# EasyEDA Pro project AUTO_TOOL_VINF_2025-05-17.epro, schematic Schematic1
Create Date: 2025-04-22; Page Name: P1; Project Name: AUTO_TOOL_VINF; Schematic Name: Schematic1; Update Date: 2025-04-24; Company: EasyEDA.com; Page Size: A4; Version: V1.0
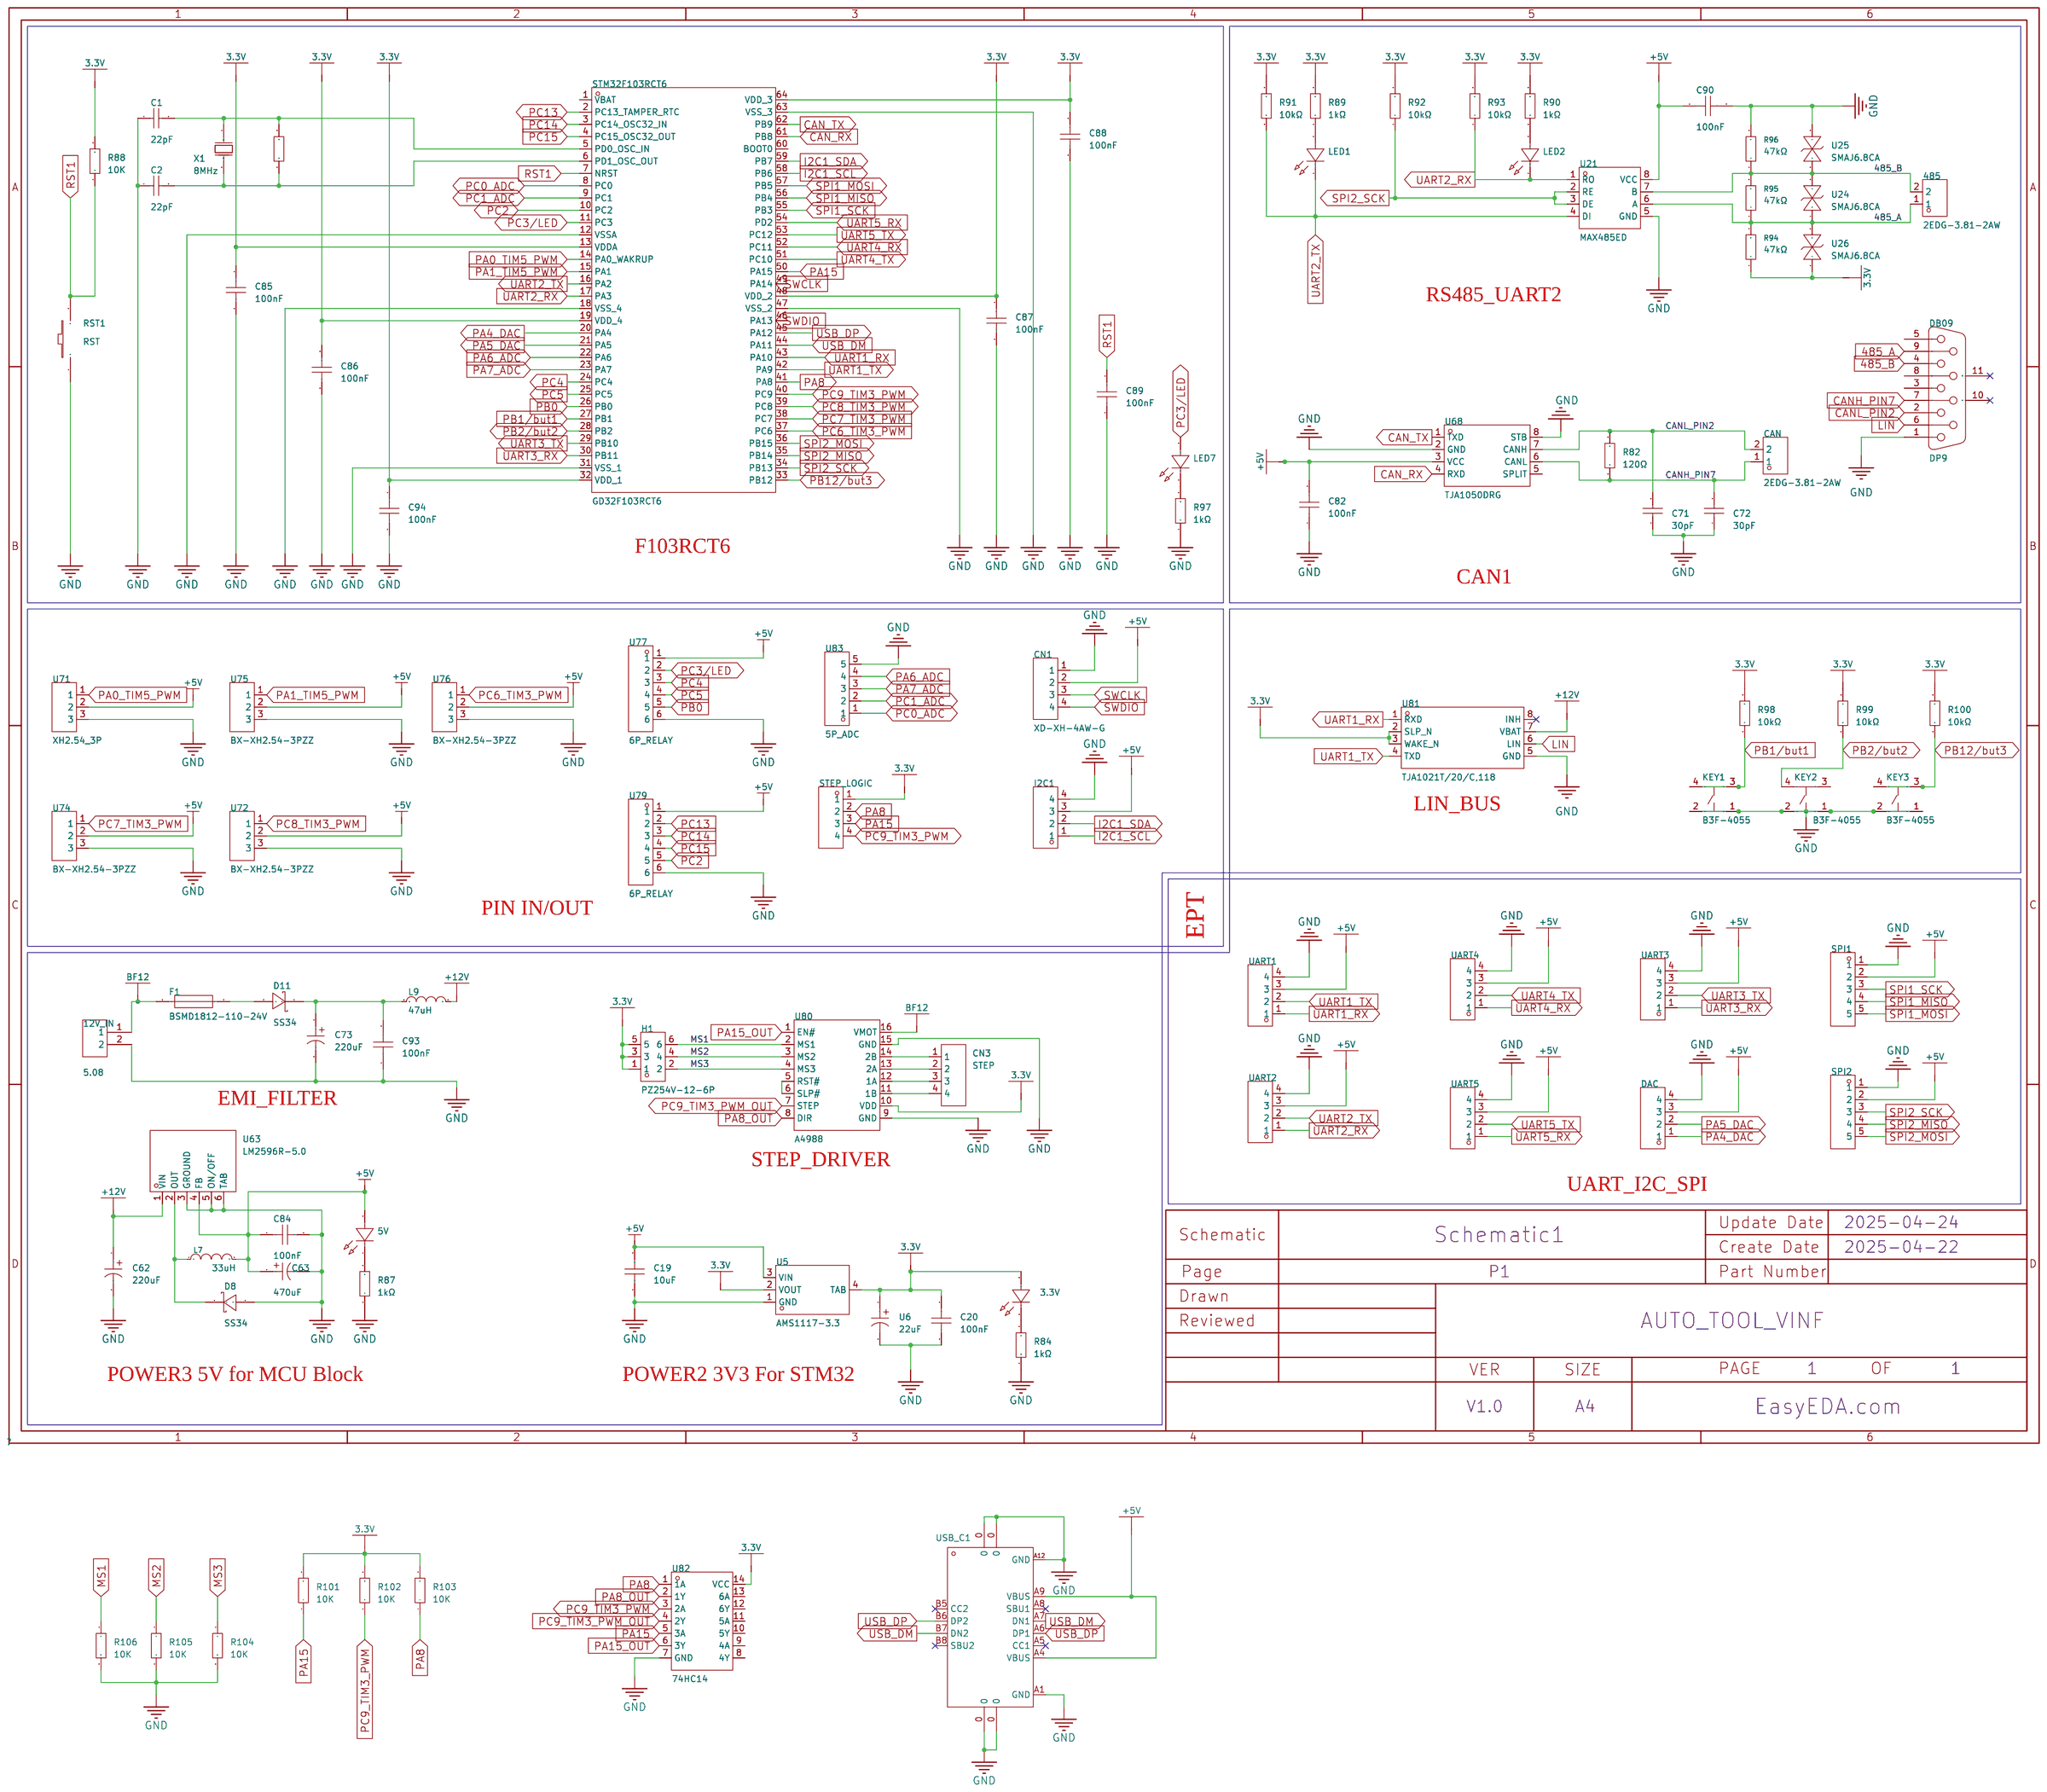
[diagram p0: schematic sheet]

## Parts
3.3V  17-21SURC/S530-A3/4T  [LED0805-RD_ORANGE]
5V  17-21SURC/S530-A3/4T  [LED0805-RD_ORANGE]
12V_IN  5.08  [CONN-TH_2P-P5.00_WJ500V-5.08-2P]
485  2EDG-3.81-2AW  [CONN-TH_2EDG-3.81-2AW]
C1  22pF  [C0603]
C2  22pF  [C0603]
C19  10uF  [C0805]
C20  100nF  [C0805]
C62  220uF  [CAP-TH_BD8.0-P3.50-D0.6-FD_1]
C63  470uF  [CAP-TH_BD8.0-P3.50-D0.5-FD]
C71  30pF  [C0603]
C72  30pF  [C0603]
C73  220uF  [CAP-TH_BD8.0-P3.50-D0.6-FD_1]
C82  100nF  [C0805]
C84  100nF  [C0805]
C85  100nF  [C0805]
C86  100nF  [C0805]
C87  100nF  [C0805]
C88  100nF  [C0805]
C89  100nF  [C0805]
C90  100nF  [C0805]
C93  100nF  [C0805]
C94  100nF  [C0805]
CAN  2EDG-3.81-2AW  [CONN-TH_2EDG-3.81-2AW]
CN1  XD-XH-4AW-G  [CONN-TH_XD-XH-4AW-G]
CN3  STEP  [CONN-TH_XD-XH-4AW-G]
D8  SS34  [SMA_L4.3-W2.6-LS5.2-RD]
D11  SS34  [SMA_L4.3-W2.6-LS5.2-RD]
DAC  ZX-XH2.54-4PZZ  [CONN-TH_4P-P2.50_4PIN]
DB09  DP9  [DSUB-TH_DMR-9P]
F1  BSMD1812-110-24V  [F1812]
H1  PZ254V-12-6P  [HDR-TH_6P-P2.54-V-M-R2-C3-S2.54]
I2C1  ZX-XH2.54-4PZZ  [CONN-TH_4P-P2.50_4PIN]
KEY1  B3F-4055  [KEY-TH_4P-L12.0-W12.0-P5.00-LS13.4-EH]
KEY2  B3F-4055  [KEY-TH_4P-L12.0-W12.0-P5.00-LS13.4-EH]
KEY3  B3F-4055  [KEY-TH_4P-L12.0-W12.0-P5.00-LS13.4-EH]
L7  33uH  [IND-SMD_L12.0-W12.0]
L9  47uH  [IND-TH_L14.5-W7.0-P7.0-D0.6_XR5026T470MVL7]
LED1  17-21SURC/S530-A3/4T  [LED0805-RD_ORANGE]
LED2  17-21SURC/S530-A3/4T  [LED0805-RD_ORANGE]
LED7  17-21SURC/S530-A3/4T  [LED0805-RD_ORANGE]
R32  1MΩ  [R0603]
R82  120Ω  [R0805]
R84  1kΩ  [R0805]
R87  1kΩ  [R0805]
R88  10K  [R0805]
R89  1kΩ  [R0805]
R90  1kΩ  [R0805]
R91  10kΩ  [R0805]
R92  10kΩ  [R0805]
R93  10kΩ  [R0805]
R94  47kΩ  [R0805]
R95  47kΩ  [R0805]
R96  47kΩ  [R0805]
R97  1kΩ  [R0805]
R98  10kΩ  [R0805]
R99  10kΩ  [R0805]
R100  10kΩ  [R0805]
R101  10K  [R0805]
R102  10K  [R0805]
R103  10K  [R0805]
R104  10K  [R0805]
R105  10K  [R0805]
R106  10K  [R0805]
RST1  RST  [SW-SMD_L6.1-W3.6-LS8.0]
SPI1  XY-XH2.54-5A11  [HDR-TH_5P-P2.50-V-F-2]
SPI2  XY-XH2.54-5A11  [HDR-TH_5P-P2.50-V-F-2]
STEP_LOGIC  ZX-XH2.54-4PZZ  [CONN-TH_4P-P2.50_4PIN]
STM32F103RCT6  GD32F103RCT6  [LQFP-64_L10.0-W10.0-P0.50-LS12.0-BL]
U5  AMS1117-3.3  [SOT-223-3_L6.5-W3.5-P3.05-LS7.0]
U6  22uF  [CAP-TH_BD4.0-P2.00-D0.5-FD]
U21  MAX485ED  [SOP-8_L4.9-W3.9-P1.27-LS6.0-BL]
U24  SMAJ6.8CA  [SMA_L4.3-W2.6-LS5.1-BI]
U25  SMAJ6.8CA  [SMA_L4.3-W2.6-LS5.1-BI]
U26  SMAJ6.8CA  [SMA_L4.3-W2.6-LS5.1-BI]
U63  LM2596R-5.0  [TO-263-5_L10.2-W8.6-P1.70-LS14.4-TL]
U68  TJA1050DRG  [SOP-8_L4.9-W3.9-P1.27-LS6.0-BL]
U71  XH2.54_3P  [CONN-TH_3P-P2.50_BX-XH2.54-3PZZ]
U72  BX-XH2.54-3PZZ  [CONN-TH_3P-P2.50_BX-XH2.54-3PZZ]
U74  BX-XH2.54-3PZZ  [CONN-TH_3P-P2.50_BX-XH2.54-3PZZ]
U75  BX-XH2.54-3PZZ  [CONN-TH_3P-P2.50_BX-XH2.54-3PZZ]
U76  BX-XH2.54-3PZZ  [CONN-TH_3P-P2.50_BX-XH2.54-3PZZ]
U77  6P_RELAY  [CONN-TH_6P-P2.50_WAFER-XH254WZ-6A]
U79  6P_RELAY  [CONN-TH_6P-P2.50_WAFER-XH254WZ-6A]
U80  A4988  [DIP-16_L20.3-W15.2-P2.54_LS12.7_A4988]
U81  TJA1021T/20/C,118  [SO-8_L4.9-W3.9-P1.27-LS5.9-BL]
U82  74HC14  [SOIC-14_L8.7-W3.9-P1.27-LS6.0-BL]
U83  5P_ADC  [CONN-TH_5P-P2.50_WAFER-XH254WZ-5A]
UART1  ZX-XH2.54-4PZZ  [CONN-TH_4P-P2.50_4PIN]
UART2  ZX-XH2.54-4PZZ  [CONN-TH_4P-P2.50_4PIN]
UART3  ZX-XH2.54-4PZZ  [CONN-TH_4P-P2.50_4PIN]
UART4  ZX-XH2.54-4PZZ  [CONN-TH_4P-P2.50_4PIN]
UART5  ZX-XH2.54-4PZZ  [CONN-TH_4P-P2.50_4PIN]
USB_C1  918-418K2023S40001  [USB-C-SMD_TYPE-C-USB-17]
X1  8MHz  [OSC-SMD_L5.0-W3.2]

## Library data of the parts
3.3V 5V LED1 LED2 LED7 = 17-21SURC/S530-A3/4T: Emitted Color:Orange-red Power Dissipation:60mW Forward Current:20mA Dominant Wavelength:624nm Dominant Wavelength:624nm Peak Wavelength:632nm Diode Configuration:- Lens Color:Colorless transparent lens Color Temperature:- Color Temperature:- Viewing Angl; LCSC Part Name: 橙红 正贴; Supplier Part: C2943978; Manufacturer: EVERLIGHT(亿光); Supplier Footprint: 0805; JLCPCB Part Class: Extended Part; Datasheet: https://atta.szlcsc.com/upload/public/pdf/source/20220318/905DC8A7115F268F033B3130889FCFCC.pdf; Supplier: LCSC; Emitted Color: Orange-red; Power Dissipation: 60mW; Forward Current: 20mA; Dominant Wavelength: 624nm; Peak Wavelength: 632nm; Lens Color: Colorless transparent lens; Viewing Angle: 140°; Mounting Sytle: Positive Stick; Operating Temperature: -40℃~+85℃
12V_IN = WJ500V-5.08-2P: Structure:1x2P Pitch:5.08mm Color:Green Mounting Style:Direct Insert Current Rating (Max):18A Voltage Rating (Max):250V Number of Pins:2P Number of Rows:1 Wire Gauge - AWG:14~30 Wire Gauge - AWG:14~30 Wire Gauge - mm2:2.5 Wire Gauge - mm2:2.5 Number of PI; LCSC Part Name: 1x2P 5.08mm 直插 排数:1 每排P数:2; Supplier Part: C8465; Manufacturer: KANGNEX(康奈克斯电气); Supplier Footprint: 插件,P=5.08mm; JLCPCB Part Class: Extended Part; Datasheet: https://atta.szlcsc.com/upload/public/pdf/source/20191225/C8465_02D34CE5B5B4A53DF5891601D97FA9F4.pdf; Supplier: LCSC; Structure: 1x2P; Pitch: 5.08mm; Color: Green; Mounting Style: Direct Insert; Current Rating (Max): 18A; Voltage Rating (Max): 250V; Number of Pins: 2P; Number of Rows: 1; Wire Gauge - AWG: 14~30; Wire Gauge - mm2: 2.5; Number of PINs Per Row: 2; Operating Temperature Range: -40℃~+105℃; Screw Specification: M2.5
485 CAN = 2EDG-3.81-2AW: Supplier Part: C22397851; Manufacturer: DLL(德利); Supplier Footprint: 弯插,P=3.81mm; Datasheet: https://atta.szlcsc.com/upload/public/pdf/source/20240513/43EA5A17C77C66A9D89BAF047811F59A.pdf; Supplier: LCSC
C1 C2 = 0603N220J500: Temperature Coefficient: Body Length:- Body Width:- Body Thickness:- Tolerance: Tolerance: Voltage Rated: Capacitance:; LCSC Part Name: 22pF ±5% 50V; Supplier Part: C107451; Manufacturer: Walsin(华新科); Supplier Footprint: 0603; Datasheet: https://atta.szlcsc.com/upload/public/pdf/source/20170726/C107451_1501054454938843912.pdf; Supplier: LCSC
C19 = CL21A106KAYNNNE_C15850: Capacitance: Tolerance:±10% Tolerance:±10% Voltage Rated: Temperature Coefficient:; LCSC Part Name: 10uF ±10% 25V; Supplier Part: C15850; Manufacturer: SAMSUNG(三星); Manufacturer Part: CL21A106KAYNNNE; Supplier Footprint: 0805; JLCPCB Part Class: Basic Part; Datasheet: https://atta.szlcsc.com/upload/public/pdf/source/20160218/1457707763339.pdf; Supplier: LCSC; Tolerance: ±10%
C20 C82 C84-C90 C93 C94 = CC0805KRX7R9BB104: Capacitance: Tolerance:±10% Tolerance:±10% Voltage Rated: Temperature Coefficient:; LCSC Part Name: 100nF ±10% 50V; Supplier Part: C49678; Manufacturer: YAGEO(国巨); Supplier Footprint: 0805; JLCPCB Part Class: Basic Part; Datasheet: https://atta.szlcsc.com/upload/public/pdf/source/20180224/C181747_15194369449651363981.pdf; Supplier: LCSC; Tolerance: ±10%
C62 C73 = 35V220uF CD110: Capacitance: Tolerance:±20% Tolerance:±20% Rated Voltage: Lead Spacing: φD: L: Operating Temperature:-40℃~+105℃ Operating Temperature:-40℃~+105℃; LCSC Part Name: 220uF ±20% 35V; Supplier Part: C2960236; Manufacturer: HRK(鸿瑞凯电子); Supplier Footprint: 插件,D8xL12mm; JLCPCB Part Class: Extended Part; Datasheet: https://atta.szlcsc.com/upload/public/pdf/source/20220224/7F5DF6788BF91316DB22641A0841F4D2.pdf; Supplier: LCSC; Tolerance: ±20%; Operating Temperature: -40℃~+105℃
C63 = 16V470uF CD288: Capacitance: Tolerance:±20% Tolerance:±20% Rated Voltage: Lead Spacing: φD: L: Operating Temperature:-40℃~+105℃ Operating Temperature:-40℃~+105℃; LCSC Part Name: 470uF ±20% 16V; Supplier Part: C2960229; Manufacturer: HRK(鸿瑞凯电子); Supplier Footprint: 插件,D8xL12mm; JLCPCB Part Class: Extended Part; Datasheet: https://atta.szlcsc.com/upload/public/pdf/source/20220224/FE29CCFF73BAE8397AB6AC08AF83FCA7.pdf; Supplier: LCSC; Tolerance: ±20%; Operating Temperature: -40℃~+105℃
C71 C72 = 0603CG300J500NT: Capacitance:30pF Tolerance:±5% Tolerance:±5% Voltage Rating:50V Temperature Coefficient:C0G; LCSC Part Name: 30pF ±5% 50V; Supplier Part: C1658; Manufacturer: FH(风华); Supplier Footprint: 0603; Datasheet: https://atta.szlcsc.com/upload/public/pdf/source/20200305/C486355_26A10D38EF8C2A5C37091D0039909270.pdf; Supplier: LCSC; Tolerance: ±5%; Voltage Rating: 50V; Temperature Coefficient: C0G
CN1 CN3 = XD-XH-4AW-G: Pins Structure:1x4P Pitch:2.54mm Mounting Type:Bend-in Reference Series:XH Number of Pins:4P Number of Rows:1 Number of PINs Per Row:4 Row Spacing:2.54mm Current Rating:3A Operating Temperature:-25℃~+85℃ Operating Temperature:-25℃~+85℃; LCSC Part Name: 1x4P 间距:2.54mm 弯插 系列:XH; Supplier Part: C17700963; Manufacturer: XUNDA(讯答); Supplier Footprint: 插件,P=2.5mm; Datasheet: https://atta.szlcsc.com/upload/public/pdf/source/20231019/EDD688933EF3B2A2948A0AD0307CAFB3.pdf; Supplier: LCSC; Pins Structure: 1x4P; Pitch: 2.54mm; Mounting Type: Bend-in; Reference Series: XH; Number of Pins: 4P; Number of Rows: 1; Number of PINs Per Row: 4; Row Spacing: 2.54mm; Current Rating: 3A; Operating Temperature: -25℃~+85℃
D8 D11 = SS34_C8678: Diode Configuration:Independent Type Forward Voltage (Vf@If):550mV@3A Reverse Voltage (Vr):40V Rectified Current:3A Reverse Leakage Current (Ir):500uA@40V; LCSC Part Name: 电压:40V 电流:3A; Supplier Part: C8678; Manufacturer: MDD(辰达半导体); Supplier Footprint: SMA(DO-214AC); JLCPCB Part Class: Basic Part; Datasheet: https://atta.szlcsc.com/upload/public/pdf/source/20240710/2118BB86FDDB2E0B294389AC1F3F65C8.pdf; Supplier: LCSC; Diode Configuration: Independent Type; Forward Voltage (Vf@If): 550mV@3A; Reverse Voltage (Vr): 40V; Rectified Current: 3A; Reverse Leakage Current (Ir): 500uA@40V
DAC I2C1 STEP_LOGIC UART1-UART5 = ZX-XH2.54-4PZZ: Pins Structure:1x4P Pitch:2.54mm Mounting Style:Straight Reference Series:XH Number of Pins:4P Number of Rows:1 Number of PINs Per Row:4 Row Spacing:- Current Rating (Max):3A Contact Material:Brass Contact Plating:Tin Operating Temperature Range:-25℃~+85℃; Supplier Part: C7429634; Manufacturer: Megastar(兆星); Supplier Footprint: 插件,P=2.54mm; JLCPCB Part Class: Extended Part; Datasheet: https://atta.szlcsc.com/upload/public/pdf/source/20230619/B529A2163E0159A644AB3383D208FB03.pdf; Supplier: LCSC; Pins Structure: 1x4P; Pitch: 2.54mm; Mounting Style: Straight; Reference Series: XH; Number of Pins: 4P; Number of Rows: 1; Number of PINs Per Row: 4; Current Rating (Max): 3A; Contact Material: Brass; Contact Plating: Tin; Operating Temperature Range: -25℃~+85℃
DB09 = D-DMR009PM-D002: Connector Type:常规D-Sub Gender:Male Number of Pins:9P Mounting Style:Bend insert Number of Rows:2 Current Rating-Signal (Max):3A Current Rating-Power (Max):- Rated Voltage (Max):- Colour:Black Operating Temperature Range:-50℃~+105℃ Operating Temperature Ra; LCSC Part Name: D-Sub 公 P数:9P; Supplier Part: C141880; Manufacturer: Ckmtw(灿科盟); Supplier Footprint: 弯插; JLCPCB Part Class: Extended Part; Datasheet: https://atta.szlcsc.com/upload/public/pdf/source/20171123/C141880_15114109678101137623.pdf; Supplier: LCSC; Connector Type: 常规D-Sub; Gender: Male; Number of Pins: 9P; Mounting Style: Bend insert; Number of Rows: 2; Current Rating-Signal (Max): 3A; Colour: Black; Operating Temperature Range: -50℃~+105℃
F1 = BSMD1812-110-24V: Voltage - Max:24V Current - Max:40A Hold Current:1.1A Trip Current:2.2A Power Dissipation:1W Resistance - Initial (Ri) (Min):45mΩ Resistance - Post Trip (R1) (Max):250mΩ Time to Trip(Max):300ms Operating Temperature:-40℃~+85℃ Operating Temperature:-40℃~+8; LCSC Part Name: 24V 1.1A 1812自恢复; Supplier Part: C883149; Manufacturer: BHFUSE(佰宏); Supplier Footprint: 1812; JLCPCB Part Class: Extended Part; Datasheet: https://atta.szlcsc.com/upload/public/pdf/source/20250227/B9B584AA29F5C747EA0BFD5D6B2BB17B.pdf; Supplier: LCSC; Voltage - Max: 24V; Current - Max: 40A; Hold Current: 1.1A; Trip Current: 2.2A; Power Dissipation: 1W; Resistance - Initial (Ri) (Min): 45mΩ; Resistance - Post Trip (R1) (Max): 250mΩ; Time to Trip(Max): 300ms; Operating Temperature: -40℃~+85℃
H1 = PZ254V-12-6P: Pin Structure:2x3P Pitch:2.54mm Row Spacing:2.54mm Circluar Pins/Square Pins:Square Pins Mounting Type:Straight Number of Rows:双排 Number of Pins:6P Current Rating (Max):- Voltage Rating (Max):- Length of Mating Pin:6mm Insulation Height:2.5mm Length of En; LCSC Part Name: 间距:2.54mm 2x3P 直插 方针; Supplier Part: C492420; Manufacturer: XFCN(兴飞); Supplier Footprint: 插件,P=2.54mm; JLCPCB Part Class: Extended Part; Datasheet: https://atta.szlcsc.com/upload/public/pdf/source/20200309/C492420_BAECB307B001054C09D200388220EAE6.pdf; Supplier: LCSC; Pin Structure: 2x3P; Pitch: 2.54mm; Row Spacing: 2.54mm; Circluar Pins/Square Pins: Square Pins; Mounting Type: Straight; Number of Rows: 双排; Number of Pins: 6P; Length of Mating Pin: 6mm; Insulation Height: 2.5mm; Length of End Connection Pin: 3mm; Operating Temperature Range: -40℃~+105℃; Color: Black
KEY1-KEY3 = B3F-4055_C84931: Circuit:SPST Actuator Style:Rectangle button Mounting Style:Direct Insert Switch Length:12mm Switch Width:12mm Switch Height:7.3mm Contact Current:50mA Voltage Rating (DC):24V With Lamp:- Mechanical Life:-; LCSC Part Name: 12*12*7.3mm 直插 轻触开关; Supplier Part: C84931; Manufacturer: OMRON(欧姆龙); Supplier Footprint: 插件; JLCPCB Part Class: Extended Part; Datasheet: https://atta.szlcsc.com/upload/public/pdf/source/20170810/C93157_1502335414592880008.pdf; Supplier: LCSC; Circuit: SPST; Actuator Style: Rectangle button; Mounting Style: Direct Insert; Switch Length: 12mm; Switch Width: 12mm; Switch Height: 7.3mm; Contact Current: 50mA; Voltage Rating (DC): 24V
L7 = SLH1207S330MTT: Inductance: Tolerance:±20% Tolerance:±20% Rated Current: DC Resistance (DCR):; LCSC Part Name: 33uH ±20%; Supplier Part: C181844; Manufacturer: Sunltech(韩国顺磁); Supplier Footprint: SMD; JLCPCB Part Class: Extended Part; Datasheet: https://atta.szlcsc.com/upload/public/pdf/source/20180509/C216200_948378E1D3CCC25B70CFE5927CB2C576.pdf; Supplier: LCSC; Tolerance: ±20%
L9 = XR5026T470MVL7: Inductance: Tolerance:±10% Tolerance:±10% Rated Current:4A Type:Magnetic ring inductance Wire Diameter:0.7mm; LCSC Part Name: 47uH ±10% 磁环电感; Supplier Part: C22358330; Manufacturer: XR(祥如); Supplier Footprint: 插件,D=14.5mm; Datasheet: https://atta.szlcsc.com/upload/public/pdf/source/20240313/542712E3DA5CB74393915CBFE698D485.pdf; Supplier: LCSC; Tolerance: ±10%; Rated Current: 4A; Type: Magnetic ring inductance; Wire Diameter: 0.7mm
R32 = 0603WAF1004T5E: Type:Thick Film Resistors Resistance:1MΩ Tolerance:±1% Tolerance:±1% Power(Watts): Overload Voltage (Max): Temperature Coefficient:±100ppm/℃ Temperature Coefficient:±100ppm/℃ Operating Temperature Range:-55℃~+155℃ Operating Temperature Range:-55℃~+155℃; LCSC Part Name: 1MΩ ±1% 100mW 厚膜电阻; Supplier Part: C22935; Manufacturer: UNI-ROYAL(厚声); Supplier Footprint: 0603; JLCPCB Part Class: Basic Part; Datasheet: https://atta.szlcsc.com/upload/public/pdf/source/20200306/C422600_1E6D84923E4A46A82E41ADD87F860B5C.pdf; Supplier: LCSC; Type: Thick Film Resistors; Tolerance: ±1%; Temperature Coefficient: ±100ppm/℃; Operating Temperature Range: -55℃~+155℃
R82 = RC0805FR-07120RL: Type:Thick Film Resistors Resistance: Tolerance:±1% Tolerance:±1% Power(Watts): Overload Voltage (Max): Temperature Coefficient:±100ppm/℃ Temperature Coefficient:±100ppm/℃ Operating Temperature Range:-55℃~+155℃ Operating Temperature Range:-55℃~+155℃; LCSC Part Name: 厚膜电阻 120Ω ±1% 125mW; Supplier Part: C114245; Manufacturer: YAGEO(国巨); Supplier Footprint: 0805; JLCPCB Part Class: Extended Part; Datasheet: https://atta.szlcsc.com/upload/public/pdf/source/20180821/C275644_0D56F95EFF785E7D9A1FEF436B37DA78.pdf; Supplier: LCSC; Type: Thick Film Resistors; Tolerance: ±1%; Temperature Coefficient: ±100ppm/℃; Operating Temperature Range: -55℃~+155℃
R84 R87-R90 R97-R106 = RC0805FR-071KL: Type:Thick Film Resistors Resistance: Tolerance:±1% Tolerance:±1% Power(Watts): Overload Voltage (Max): Temperature Coefficient:±100ppm/℃ Temperature Coefficient:±100ppm/℃ Operating Temperature Range:-55℃~+155℃ Operating Temperature Range:-55℃~+155℃; LCSC Part Name: 厚膜电阻 1kΩ ±1% 125mW; Supplier Part: C95781; Manufacturer: YAGEO(国巨); Supplier Footprint: 0805; JLCPCB Part Class: Extended Part; Datasheet: https://atta.szlcsc.com/upload/public/pdf/source/20170708/1499509500945.pdf; Supplier: LCSC; Type: Thick Film Resistors; Tolerance: ±1%; Temperature Coefficient: ±100ppm/℃; Operating Temperature Range: -55℃~+155℃
R91-R93 = RC0805FR-0710KL: Type:Thick Film Resistors Resistance: Tolerance:±1% Tolerance:±1% Power(Watts): Overload Voltage (Max): Temperature Coefficient:±100ppm/℃ Temperature Coefficient:±100ppm/℃ Operating Temperature Range:-55℃~+155℃ Operating Temperature Range:-55℃~+155℃; LCSC Part Name: 厚膜电阻 10kΩ ±1% 125mW; Supplier Part: C84376; Manufacturer: YAGEO(国巨); Supplier Footprint: 0805; JLCPCB Part Class: Extended Part; Datasheet: https://atta.szlcsc.com/upload/public/pdf/source/20170708/1499509500945.pdf; Supplier: LCSC; Type: Thick Film Resistors; Tolerance: ±1%; Temperature Coefficient: ±100ppm/℃; Operating Temperature Range: -55℃~+155℃
R94-R96 = 0805W8F4702T5E: Type:Thick Film Resistors Resistance:47kΩ Tolerance:±1% Tolerance:±1% Power(Watts): Overload Voltage (Max): Temperature Coefficient:±100ppm/℃ Temperature Coefficient:±100ppm/℃ Operating Temperature Range:-55℃~+155℃ Operating Temperature Range:-55℃~+155℃; LCSC Part Name: 47kΩ ±1% 125mW 厚膜电阻; Supplier Part: C17713; Manufacturer: UNI-ROYAL(厚声); Supplier Footprint: 0805; JLCPCB Part Class: Basic Part; Datasheet: https://atta.szlcsc.com/upload/public/pdf/source/20200306/C422600_1E6D84923E4A46A82E41ADD87F860B5C.pdf; Supplier: LCSC; Type: Thick Film Resistors; Tolerance: ±1%; Temperature Coefficient: ±100ppm/℃; Operating Temperature Range: -55℃~+155℃
RST1 = 轻触开关,3*6*2.5塑头白色,260G,行程0.25mm,贴片 (SMT业务专用): LCSC Part Name: 轻触开关,3*6*2.5塑头白色,260G,行程0.25mm,贴片   (SMT业务专用); Supplier Part: C71857; Supplier Footprint: SMD; JLCPCB Part Class: Extended Part; Datasheet: https://atta.szlcsc.com/upload/public/pdf/source/20160427/1461725218304.pdf; Supplier: LCSC
SPI1 SPI2 = XY-XH2.54-5A11: Pins Structure:1x5P Pitch:2.54mm Mounting Style:Straight Number of Pins:5P Number of Rows:1 Number of PINs Per Row:5 Row Spacing:2.54mm Current Rating (Max):2A Operating Temperature Range:-25℃~+85℃ Operating Temperature Range:-25℃~+85℃; LCSC Part Name: 1x5P 间距:2.54mm 直插; Supplier Part: C19271371; Manufacturer: XYECONN(辛译); Supplier Footprint: 插件,P=2.54mm; JLCPCB Part Class: Extended Part; Datasheet: https://atta.szlcsc.com/upload/public/pdf/source/20231124/FE6C94FEE8E92153564DB6B2026F1152.pdf; Supplier: LCSC; Pins Structure: 1x5P; Pitch: 2.54mm; Mounting Style: Straight; Number of Pins: 5P; Number of Rows: 1; Number of PINs Per Row: 5; Row Spacing: 2.54mm; Current Rating (Max): 2A; Operating Temperature Range: -25℃~+85℃
STM32F103RCT6 = GD32F103RCT6: CPU Core:CM3 Program Storage Size:256KB RAM Size:48KB GPIO Ports Number:51 Operating Voltage Range:2.6V~3.6V Operating Voltage Range:2.6V~3.6V CPU Maximum Speed:108MHz Program Memory Type:FLASH Operating Temperature Range:-40℃~+85℃ Operating Temperature R; LCSC Part Name: Arm® Cortex®-M3 32-bit MCU; Supplier Part: C80687; Manufacturer: GigaDevice(兆易创新); Supplier Footprint: LQFP-64(10x10); JLCPCB Part Class: Extended Part; Datasheet: https://atta.szlcsc.com/upload/public/pdf/source/20160910/1473490296871.pdf; Supplier: LCSC; CPU Core: CM3; Program Storage Size: 256KB; RAM Size: 48KB; GPIO Ports Number: 51; Operating Voltage Range: 2.6V~3.6V; CPU Maximum Speed: 108MHz; Program Memory Type: FLASH; Operating Temperature Range: -40℃~+85℃; ADC (Bit): 12bit; DAC (Bit): 12bit; PWM (Bit): 16bit; 16Bit Timer: 6; CAN: 1; UART/USART: 5; I2C: 2; SPI: 3; Universal Serial Bus: 有; Peripheral/Function: On-chip temperature sensor；DMA；WDT；LIN总线协议；PWM；IrDA；SDIO；RTC实时时钟; Watchdog: 有; Real-Time Clock: 有; Infrared Data Association: 有; Secure Digital Input and Output: 有; Direct Memory Access: 有; Internal Oscillator: 有
U5 = AMS1117-3.3_C5250992: Output Type:Fixed Maximum Input Voltage:12V Output Voltage:3.3V Output Voltage:3.3V Output Current:1A Power Supply Rejection Ratio (PSRR):70dB@(120Hz) Operating Temperature:-40℃~+125℃@(Tj) Operating Temperature:-40℃~+125℃@(Tj) Output Polarity:Positive ele; Supplier Part: C5250992; Manufacturer: TWGMC(台湾迪嘉); Supplier Footprint: SOT-223-3L; JLCPCB Part Class: Extended Part; Datasheet: https://atta.szlcsc.com/upload/public/pdf/source/20221109/A58A92B07670E85D28928AE371260E8D.pdf; Supplier: LCSC; Output Type: Fixed; Maximum Input Voltage: 12V; Output Voltage: 3.3V; Output Current: 1A; Power Supply Rejection Ratio (PSRR): 70dB@(120Hz); Operating Temperature: -40℃~+125℃@(Tj); Output Polarity: Positive electrode; Number of Outputs: 1
U6 = KM1E220M0407: Capacitance:22uF Tolerance:±20% Tolerance:±20% Voltage Rating:25V Ripple Current:48mA@120kHz Equivalent Series Resistance(ESR):- Pin Spacing:- Diameter:4mm Height - Seated (Max):7mm Lifetime:2000hrs@105℃ Operating Temperature:-40℃~+105℃ Operating Temperat; LCSC Part Name: 22uF ±20% 25V; Supplier Part: C2873975; Manufacturer: ROQANG(容强); Supplier Footprint: 插件,D4xL7mm; JLCPCB Part Class: Extended Part; Datasheet: https://atta.szlcsc.com/upload/public/pdf/source/20210825/43CC5C3A3C9845108B639C21E16A1224.pdf; Supplier: LCSC; Tolerance: ±20%; Voltage Rating: 25V; Ripple Current: 48mA@120kHz; Diameter: 4mm; Height - Seated (Max): 7mm; Lifetime: 2000hrs@105℃; Operating Temperature: -40℃~+105℃
U21 = MAX485ED: Supplier Part: C481667; Manufacturer: HTC; Supplier Footprint: SOP-8; JLCPCB Part Class: Extended Part; Datasheet: https://atta.szlcsc.com/upload/public/pdf/source/20200113/C481667_86CA12344B2034BBC3F3085D860BEB7C.pdf; Supplier: LCSC
U24-U26 = SMAJ6.8CA_1: Reverse Stand-Off Voltage (Vrwm):5.8V Maximum Clamping Voltage:- Peak Pulse Current (Ipp)@10/1000us:39A Breakdown Voltage:6.45V Type:TVS; LCSC Part Name: SMAJ6.8CA 双向TVS 5.8V截止; Supplier Part: C7495256; Manufacturer: HXY MOSFET(华轩阳电子); Supplier Footprint: SMA; JLCPCB Part Class: Extended Part; Datasheet: https://atta.szlcsc.com/upload/public/pdf/source/20230721/726FC91038932BB1F4EB627FF3914F5A.pdf; Supplier: LCSC; Reverse Stand-Off Voltage (Vrwm): 5.8V; Peak Pulse Current (Ipp)@10/1000us: 39A; Breakdown Voltage: 6.45V; Type: TVS
U63 = LM2596R-5.0: Function:Step-down type Input Voltage:- Input Voltage:- Output Current:3A Switching Frequency:150kHz Switching Frequency:150kHz Operating Temperature:-40℃~+125℃@(TJ) Operating Temperature:-40℃~+125℃@(TJ) Synchronous Rectification:- Number of Outputs:1 Top; Supplier Part: C77782; Manufacturer: HTC; Supplier Footprint: TO-263-5; JLCPCB Part Class: Extended Part; Datasheet: https://atta.szlcsc.com/upload/public/pdf/source/20161217/1481939175231.pdf; Supplier: LCSC; Function: Step-down type; Output Current: 3A; Switching Frequency: 150kHz; Operating Temperature: -40℃~+125℃@(TJ); Number of Outputs: 1; Topology: Step-down; Switch tube (built-in/external): Built-in
U68 = TJA1050DRG: Supplier Part: C19723770; Manufacturer: HGC(深圳汉芯); Supplier Footprint: SOP-8; JLCPCB Part Class: Extended Part; Datasheet: https://atta.szlcsc.com/upload/public/pdf/source/20231229/9EC40A6172CAB0350BF7AF3421F4DEBF.pdf; Supplier: LCSC
U71 U72 U74-U76 = BX-XH2.54-3PZZ: Pins Structure:1x3P Pitch:2.5mm Mounting Type:Direct Insert Reference Series:XH Number of Pins:3P Number of Rows:1 Number of PINs Per Row:3 Row Spacing:- Current Rating:3A Contact Material:Brass Contact Plating:Tin Operating Temperature:-25℃~+85℃ Operatin; LCSC Part Name: 1x3P 间距:2.5mm 直插 系列:XH; Supplier Part: C18077834; Manufacturer: Bossie(博锡); Supplier Footprint: 插件,P=2.54mm; JLCPCB Part Class: Extended Part; Datasheet: https://atta.szlcsc.com/upload/public/pdf/source/20231017/BF89167887E1F965B2791D14EC788A09.pdf; Supplier: LCSC; Pins Structure: 1x3P; Pitch: 2.5mm; Mounting Type: Direct Insert; Reference Series: XH; Number of Pins: 3P; Number of Rows: 1; Number of PINs Per Row: 3; Current Rating: 3A; Contact Material: Brass; Contact Plating: Tin; Operating Temperature: -25℃~+85℃; Voltage Rating: 250V; Plastic Material: PA66; Flame Retardant Rating: UL94V-0; Color: White; Z-Height of the Board: 7mm; X-Length of Bottom Edge on Board (Spacing Line): 10mm; Y-Width of Bottom Edge on Board: 5.9mm
U77 U79 = WAFER-XH254WZ-6A: Pins Structure:1x6P Pitch:2.54mm Mounting Style:Right-Angle Reference Series:XH Number of Pins:6P Number of Rows:1 Number of PINs Per Row:6 Current Rating (Max):3A Operating Temperature Range:-25℃~+85℃ Operating Temperature Range:-25℃~+85℃; Supplier Part: C7432695; Manufacturer: HANBO(汉博); Supplier Footprint: 插件,P=2.5mm; Datasheet: https://atta.szlcsc.com/upload/public/pdf/source/20230721/127D646758C1D4B76FEF9901992220E1.pdf; Supplier: LCSC; Pins Structure: 1x6P; Pitch: 2.54mm; Mounting Style: Right-Angle; Reference Series: XH; Number of Pins: 6P; Number of Rows: 1; Number of PINs Per Row: 6; Current Rating (Max): 3A; Operating Temperature Range: -25℃~+85℃
U80 = A4988: Supplier Part: C9900168373; Supplier Footprint: 插件; Supplier: LCSC
U81 = TJA1021T/20/C,118: Type:Transceiver Duplex:Full Duplex Number of Drivers:1 Number of Receivers:1 Supply Voltage:5.5V~27V Supply Voltage:5.5V~27V Lag of Receiver:175mV; Supplier Part: C271675; Manufacturer: NXP(恩智浦); Supplier Footprint: SO-8; JLCPCB Part Class: Extended Part; Datasheet: https://www.nxp.com/docs/en/data-sheet/TJA1021.pdf; Supplier: LCSC; Type: Transceiver; Duplex: Full Duplex; Number of Drivers: 1; Number of Receivers: 1; Supply Voltage: 5.5V~27V; Lag of Receiver: 175mV
U82 = 74HC14_C5356103: Input Type:- Supply Voltage(Single):2V~6V Supply Voltage(Single):2V~6V Supply Current (Max):- Number of Circuits:6 Number of Inputs:- Sink Current:- Source Current:- High level range (VIH):- High level range (VIH):- Low level range (VIL):- Low level range; Supplier Part: C5356103; Manufacturer: JSMSEMI(杰盛微); Supplier Footprint: SOP-14; Datasheet: https://atta.szlcsc.com/upload/public/pdf/source/20240105/B746F3C4B5C6D4D99FE5FAFADEAB26B9.pdf; Supplier: LCSC; Supply Voltage(Single): 2V~6V; Number of Circuits: 6; Series: 74HCSeries
U83 = WAFER-XH254WZ-5A: Pins Structure:1x5P Pitch:2.54mm Mounting Style:Bend insert Reference Series:XH Number of Pins:5P Number of Rows:1 Number of PINs Per Row:5 Current Rating (Max):3A Operating Temperature Range:-25℃~+85℃ Operating Temperature Range:-25℃~+85℃; Supplier Part: C7432694; Manufacturer: HANBO(汉博); Supplier Footprint: 插件,P=2.5mm; Datasheet: https://atta.szlcsc.com/upload/public/pdf/source/20230721/127D646758C1D4B76FEF9901992220E1.pdf; Supplier: LCSC; Pins Structure: 1x5P; Pitch: 2.54mm; Mounting Style: Bend insert; Reference Series: XH; Number of Pins: 5P; Number of Rows: 1; Number of PINs Per Row: 5; Current Rating (Max): 3A; Operating Temperature Range: -25℃~+85℃
USB_C1 = 918-418K2023S40001: Connector Type:Type-C Standard:- Gender:Female Number of Contacts:16P Number of Ports:1 Current Rating - Power (Max):3A; LCSC Part Name: Type-C 母座; Supplier Part: C167321; Manufacturer: 精拓金; Supplier Footprint: SMD; JLCPCB Part Class: Extended Part; Datasheet: https://atta.szlcsc.com/upload/public/pdf/source/20210305/C167321_3BB79E85CEB6874BF587E64926D16F83.pdf; Supplier: LCSC; Connector Type: Type-C; Gender: Female; Number of Contacts: 16P; Number of Ports: 1; Current Rating - Power (Max): 3A
X1 = TAXM8M2QLFCDT1T: Crystal Type:SMD Crystal Resonator Frequency: Frequency Tolerance:±30ppm Frequency Tolerance:±30ppm Frequency Stability:±20ppm Frequency Stability:±20ppm Load Capacitance: Equivalent Series Resistance (ESR):80Ω Operating Temperature: Operating Temperature; LCSC Part Name: 8MHz ±30ppm 20pF; Supplier Part: C122522; Manufacturer: TAE(雅晶鑫); Supplier Footprint: SMD5032-2P; JLCPCB Part Class: Extended Part; Datasheet: https://atta.szlcsc.com/upload/public/pdf/source/20220113/59EE8A0E7B9F67FF1BF3C454890DE4E5.pdf; Supplier: LCSC; Crystal Type: SMD Crystal Resonator; Frequency Tolerance: ±30ppm; Frequency Stability: ±20ppm; Equivalent Series Resistance (ESR): 80Ω

## Nets
3.3V: 3.3V.2(A) C20.1 C85.1 C86.1 C87.1 C88.1 C94.1 H1.1 H1.3 H1.5 R88.2 R89.2 R90.2 R91.2 R92.2 R93.2 R94.1 R98.2 R99.2 R100.2 R101.2 R102.2 R103.2 STEP_LOGIC.1 STM32F103RCT6.13(VDDA) STM32F103RCT6.19(VDD_4) STM32F103RCT6.32(VDD_1) STM32F103RCT6.48(VDD_2) STM32F103RCT6.64(VDD_3) U5.2(VOUT) U5.4(TAB) U6.1 U26.1(K) U80.10(VDD) U81.2(SLP_N) U81.3(WAKE_N) U82.14(VCC)
+5V: 5V.2(A) C19.2 C63.1 C82.2 C84.1 C90.1 CN1.2 DAC.3 I2C1.3 L7.2 SPI1.2 SPI2.2 U5.3(VIN) U21.8(VCC) U63.4(FB) U68.3(VCC) U71.2 U72.2 U74.2 U75.2 U76.2 U77.1 U79.1 UART1.3 UART2.3 UART3.3 UART4.3 UART5.3 USB_C1.A4(VBUS) USB_C1.A9(VBUS)
+12V: C62.1 L9.2 U63.1(VIN) U81.7(VBAT)
GND: 12V_IN.2 C1.1 C2.1 C19.1 C20.2 C62.2 C63.2 C71.1 C72.1 C73.2 C82.1 C84.2 C85.2 C86.2 C87.2 C88.2 C89.2 C90.2 C93.1 C94.2 CN1.1 D8.2(A) DAC.4 DB09.1 I2C1.4 KEY1.1 KEY1.2 KEY2.1 KEY2.2 KEY3.1 KEY3.2 R84.1 R87.1 R96.2 R97.1 R104.2 R105.2 R106.2 RST1.1 SPI1.1 SPI2.1 STM32F103RCT6.12(VSSA) STM32F103RCT6.18(VSS_4) STM32F103RCT6.31(VSS_1) STM32F103RCT6.47(VSS_2) STM32F103RCT6.63(VSS_3) U5.1(GND) U6.2 U21.5(GND) U25.2(A) U63.3(GROUND) U63.5(ON/OFF) U63.6(TAB) U68.2(GND) U68.8(STB) U71.3 U72.3 U74.3 U75.3 U76.3 U77.6 U79.6 U80.9(GND) U80.15(GND) U81.5(GND) U82.7(GND) U83.5 UART1.4 UART2.4 UART3.4 UART4.4 UART5.4 USB_C1.0 USB_C1.A1(GND) USB_C1.A12(GND)
485_A: 485.1 DB09.9 R94.2 R95.1 U21.6(A) U24.1(K) U26.2(A)
485_B: 485.2 DB09.4 R95.2 R96.1 U21.7(B) U24.2(A) U25.1(K)
BF12: 12V_IN.1 F1.1 U80.16(VMOT)
CAN_RX: STM32F103RCT6.61(PB8) U68.4(RXD)
CAN_TX: STM32F103RCT6.62(PB9) U68.1(TXD)
CANH_PIN7: C72.2 CAN.1 DB09.7 R82.1 U68.6(CANL)
CANL_PIN2: C71.2 CAN.2 DB09.2 R82.2 U68.7(CANH)
I2C1_SCL: I2C1.1 STM32F103RCT6.58(PB6)
I2C1_SDA: I2C1.2 STM32F103RCT6.59(PB7)
LIN: DB09.6 U81.6(LIN)
MS1: H1.6 R106.1 U80.2(MS1)
MS2: H1.4 R105.1 U80.3(MS2)
MS3: H1.2 R104.1 U80.4(MS3)
PA0_TIM5_PWM: STM32F103RCT6.14(PA0_WAKRUP) U71.1
PA1_TIM5_PWM: STM32F103RCT6.15(PA1) U75.1
PA4_DAC: DAC.1 STM32F103RCT6.20(PA4)
PA5_DAC: DAC.2 STM32F103RCT6.21(PA5)
PA6_ADC: STM32F103RCT6.22(PA6) U83.4
PA7_ADC: STM32F103RCT6.23(PA7) U83.3
PA8: R103.1 STEP_LOGIC.2 STM32F103RCT6.41(PA8) U82.1(1A)
PA8_OUT: U80.8(DIR) U82.2(1Y)
PA15: R101.1 STEP_LOGIC.3 STM32F103RCT6.50(PA15) U82.5(3A)
PA15_OUT: U80.1(EN#) U82.6(3Y)
PB0: STM32F103RCT6.26(PB0) U77.5
PB1/but1: KEY1.3 KEY1.4 R98.1 STM32F103RCT6.27(PB1)
PB2/but2: KEY2.4 R99.1 STM32F103RCT6.28(PB2)
PB12/but3: KEY3.3 KEY3.4 R100.1 STM32F103RCT6.33(PB12)
PC0_ADC: STM32F103RCT6.8(PC0) U83.1
PC1_ADC: STM32F103RCT6.9(PC1) U83.2
PC2: STM32F103RCT6.10(PC2) U79.5
PC3/LED: LED7.2(A) STM32F103RCT6.11(PC3) U77.2
PC4: STM32F103RCT6.24(PC4) U77.3
PC5: STM32F103RCT6.25(PC5) U77.4
PC6_TIM3_PWM: STM32F103RCT6.37(PC6) U76.1
PC7_TIM3_PWM: STM32F103RCT6.38(PC7) U74.1
PC8_TIM3_PWM: STM32F103RCT6.39(PC8) U72.1
PC9_TIM3_PWM: R102.1 STEP_LOGIC.4 STM32F103RCT6.40(PC9) U82.3(2A)
PC9_TIM3_PWM_OUT: U80.7(STEP) U82.4(2Y)
PC13: STM32F103RCT6.2(PC13_TAMPER_RTC) U79.2
PC14: STM32F103RCT6.3(PC14_OSC32_IN) U79.3
PC15: STM32F103RCT6.4(PC15_OSC32_OUT) U79.4
RST1: C89.1 R88.1 RST1.2 STM32F103RCT6.7(NRST)
SPI1_MISO: SPI1.4 STM32F103RCT6.56(PB4)
SPI1_MOSI: SPI1.5 STM32F103RCT6.57(PB5)
SPI1_SCK: SPI1.3 STM32F103RCT6.55(PB3)
SPI2_MISO: SPI2.4 STM32F103RCT6.35(PB14)
SPI2_MOSI: SPI2.5 STM32F103RCT6.36(PB15)
SPI2_SCK: R92.1 SPI2.3 STM32F103RCT6.34(PB13) U21.2(RE) U21.3(DE)
SWCLK: CN1.3 STM32F103RCT6.49(PA14)
SWDIO: CN1.4 STM32F103RCT6.46(PA13)
UART1_RX: STM32F103RCT6.43(PA10) U81.1(RXD) UART1.1
UART1_TX: STM32F103RCT6.42(PA9) U81.4(TXD) UART1.2
UART2_RX: LED2.1(K) R93.1 STM32F103RCT6.17(PA3) U21.1(RO) UART2.1
UART2_TX: LED1.1(K) R91.1 STM32F103RCT6.16(PA2) U21.4(DI) UART2.2
UART3_RX: STM32F103RCT6.30(PB11) UART3.1
UART3_TX: STM32F103RCT6.29(PB10) UART3.2
UART4_RX: STM32F103RCT6.52(PC11) UART4.1
UART4_TX: STM32F103RCT6.51(PC10) UART4.2
UART5_RX: STM32F103RCT6.54(PD2) UART5.1
UART5_TX: STM32F103RCT6.53(PC12) UART5.2
USB_DM: STM32F103RCT6.44(PA11) USB_C1.A7(DN1) USB_C1.B7(DN2)
USB_DP: STM32F103RCT6.45(PA12) USB_C1.A6(DP1) USB_C1.B6(DP2)
$1N1838: C1.2 R32.2 STM32F103RCT6.5(PD0_OSC_IN) X1.1(OSC1)
$1N1839: C2.2 R32.1 STM32F103RCT6.6(PD1_OSC_OUT) X1.2(OSC2)
$1N2268: D8.1(K) L7.1 U63.2(OUT)
$1N2271: 5V.1(K) R87.2
$1N2571: 3.3V.1(K) R84.2
$1N3602: LED1.2(A) R89.1
$1N3604: LED2.2(A) R90.1
$1N6121: LED7.1(K) R97.2
$1N6470: C73.1 C93.2 D11.1(K) L9.1
$1N6472: D11.2(A) F1.2
$1N7969: CN3.1 U80.14(2B)
$1N7972: CN3.2 U80.13(2A)
$1N7975: CN3.3 U80.12(1A)
$1N7978: CN3.4 U80.11(1B)
$1N8015: U80.5(RST#) U80.6(SLP#)

Not connected (* = marked no-connect by the designer): DB09 3 5 8 10(MH1)* 11(MH2)*; KEY2 3; STM32F103RCT6 1(VBAT) 60(BOOT0); U68 5(SPLIT); U81 8(INH)*; U82 8(4Y) 9(4A) 10(5Y) 11(5A) 12(6Y) 13(6A); USB_C1 A5(CC1)* A8(SBU1)* B5(CC2)* B8(SBU2)*

## Notes on the sheet
- RS485_UART2
- F103RCT6
- CAN1
- LIN_BUS
- PIN IN/OUT
- EPT
- EMI_FILTER
- STEP_DRIVER
- UART_I2C_SPI
- POWER3 5V for MCU Block
- POWER2 3V3 For STM32
